# EAGLE design Modulo de expansao_01 (EAGLE 7.6.0)
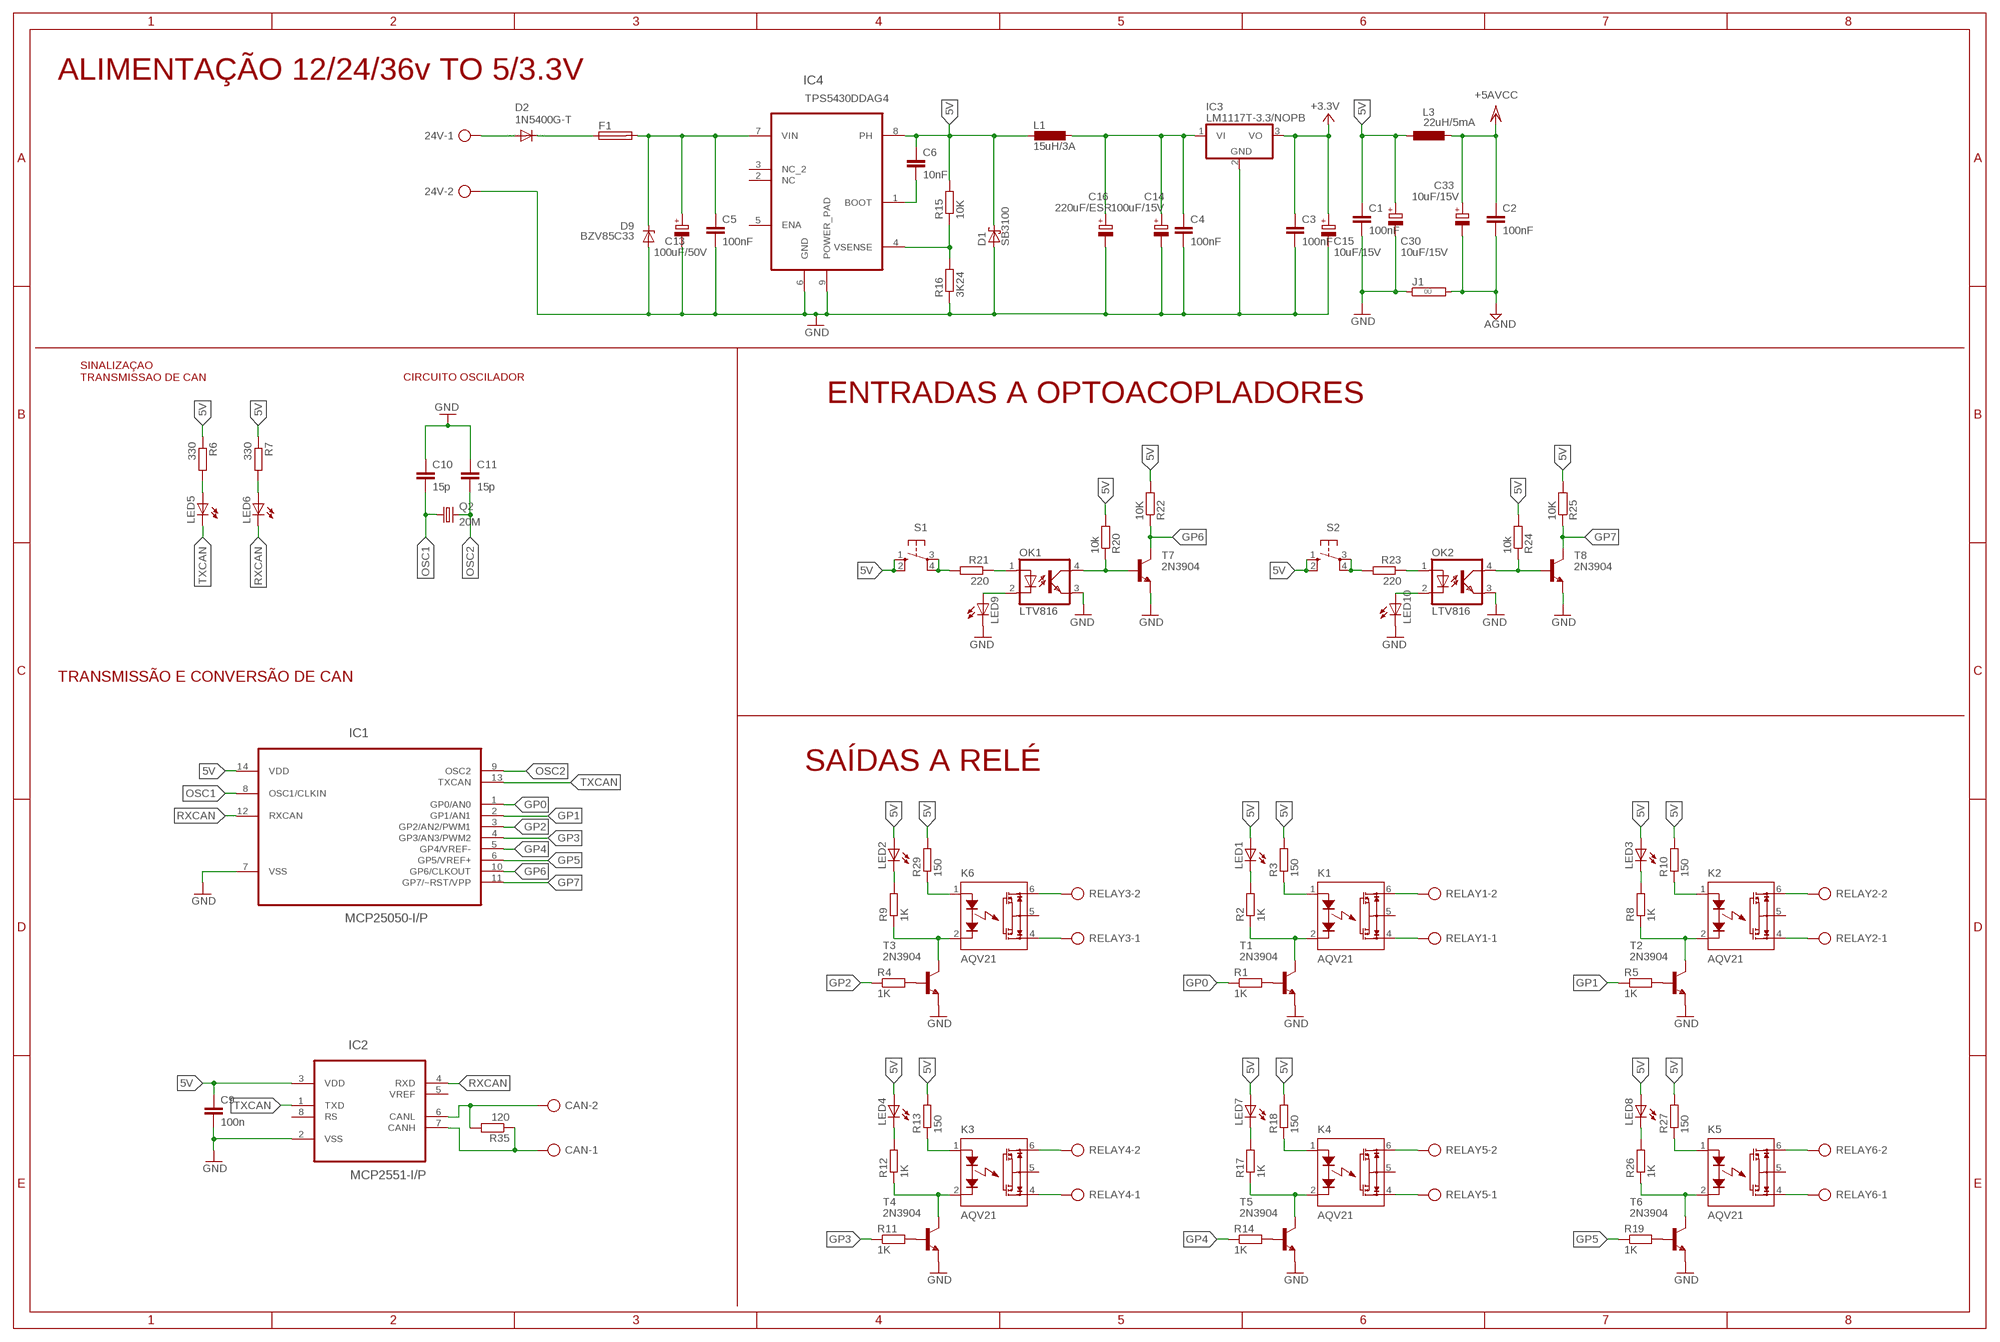
[diagram p0: schematic, sheet 1]

## Parts
24V  AK300/2  [AK300/2]
C1  100nF  C-EU050-024X044  [C050-024X044]
C2  100nF  C-EU050-024X044  [C050-024X044]
C3  100nF  C-EU050-024X044  [C050-024X044]
C4  100nF  C-EU050-024X044  [C050-024X044]
C5  100nF  C-EU050-024X044  [C050-024X044]
C6  10nF  C-EU025-025X050  [C025-025X050]
C9  100n  C-EU050-024X044  [C050-024X044]
C10  15p  C-EU025-024X044  [C025-024X044]
C11  15p  C-EU025-024X044  [C025-024X044]
C13  100uF/50V  CPOL-EUE3.5-10  [E3,5-10]
C14  100uF/15V  CPOL-EUE2-5  [E2-5]
C15  10uF/15V  CPOL-EUE2-5  [E2-5]
C16  220uF/ESR  CPOL-EUE2.5-7  [E2,5-7]
C30  10uF/15V  CPOL-EUE2.5-6  [E2,5-6]
C33  10uF/15V  CPOL-EUE2.5-6  [E2,5-6]
CAN  AK300/2  [AK300/2]
D1  SB3100  SCHOTTKY-DIODEDO201T15  [DO201T15]
D2  1N5400G-T  1N5624  [DO201-15]
D9  BZV85C33  BZV10  [DO34Z7]
F1  TR5  [TR5]
IC1  MCP25050-I/P  [DIP254P762X432-14]
IC2  MCP2551-I/P  [DIP254P762X432-8]
IC3  LM1117T-3.3/NOPB  LM340H-12  [TO220H]
IC4  TPS5430DDAG4  [SOIC127P600X170-9N]
J1  0R  [0R/10]
K1  AQV21  [DIL06]
K2  AQV21  [DIL06]
K3  AQV21  [DIL06]
K4  AQV21  [DIL06]
K5  AQV21  [DIL06]
K6  AQV21  [DIL06]
L1  15uH/3A  L-EU6000-XXX-RC  [6000-XXXX-RC]
L3  22uH/5mA  L-EU6000-XXX-RC  [6000-XXXX-RC]
LED1  LED3MM  [LED3MM]
LED2  LED3MM  [LED3MM]
LED3  LED3MM  [LED3MM]
LED4  LED3MM  [LED3MM]
LED5  LED3MM  [LED3MM]
LED6  LED3MM  [LED3MM]
LED7  LED3MM  [LED3MM]
LED8  LED3MM  [LED3MM]
LED9  LED3MM  [LED3MM]
LED10  LED3MM  [LED3MM]
OK1  LTV816  [DIL04]
OK2  LTV816  [DIL04]
Q2  20M  CRYSTALHC49S  [HC49/S]
R1  1K  R-EU_0207/10  [0207/10]
R2  1K  R-EU_0207/10  [0207/10]
R3  150  R-EU_0207/10  [0207/10]
R4  1K  R-EU_0207/10  [0207/10]
R5  1K  R-EU_0207/10  [0207/10]
R6  330  R-EU_0207/10  [0207/10]
R7  330  R-EU_0207/10  [0207/10]
R8  1K  R-EU_0207/10  [0207/10]
R9  1K  R-EU_0207/10  [0207/10]
R10  150  R-EU_0207/10  [0207/10]
R11  1K  R-EU_0207/10  [0207/10]
R12  1K  R-EU_0207/10  [0207/10]
R13  150  R-EU_0207/10  [0207/10]
R14  1K  R-EU_0207/10  [0207/10]
R15  10K  R-EU_0207/10  [0207/10]
R16  3K24  R-EU_0207/10  [0207/10]
R17  1K  R-EU_0207/10  [0207/10]
R18  150  R-EU_0207/10  [0207/10]
R19  1K  R-EU_0207/10  [0207/10]
R20  10k  R-EU_0207/10  [0207/10]
R21  220  R-EU_0207/10  [0207/10]
R22  10K  R-EU_0207/10  [0207/10]
R23  220  R-EU_0207/10  [0207/10]
R24  10k  R-EU_0207/10  [0207/10]
R25  10K  R-EU_0207/10  [0207/10]
R26  1K  R-EU_0207/10  [0207/10]
R27  150  R-EU_0207/10  [0207/10]
R29  150  R-EU_0207/10  [0207/10]
R35  120  R-EU_0207/10  [0207/10]
RELAY1  AK300/2  [AK300/2]
RELAY2  AK300/2  [AK300/2]
RELAY3  AK300/2  [AK300/2]
RELAY4  AK300/2  [AK300/2]
RELAY5  AK300/2  [AK300/2]
RELAY6  AK300/2  [AK300/2]
S1  10-XX  [B3F-10XX]
S2  10-XX  [B3F-10XX]
T1  2N3904  [TO92]
T2  2N3904  [TO92]
T3  2N3904  [TO92]
T4  2N3904  [TO92]
T5  2N3904  [TO92]
T6  2N3904  [TO92]
T7  2N3904  [TO92]
T8  2N3904  [TO92]

## Nets
5V: C1.1 C6.1 C9.1 C30.+ D1.C IC1.14(VDD) IC2.3(VDD) IC4.8(PH) L1.2 L3.1 LED1.A LED2.A LED3.A LED4.A LED7.A LED8.A R3.2 R6.1 R7.1 R10.2 R13.2 R15.2 R18.2 R20.2 R22.2 R24.2 R25.2 R27.2 R29.2 S1.1(S) S1.2(S1) S2.1(S) S2.2(S1)
24V: 24V.1 D2.A
+3.3V: C3.1 C15.+ IC3.3(VO)
AGND: C2.2 C33.- J1.2
GND: 24V.2 C1.2 C3.2 C4.2 C5.2 C9.2 C10.1 C11.1 C13.- C14.- C15.- C16.- C30.- D1.A D9.A IC1.7(VSS) IC2.2(VSS) IC3.2(GND) IC4.6(GND) IC4.9(POWER_PAD) J1.1 LED9.K(C) LED10.K(C) OK1.3(EMIT) OK2.3(EMIT) R16.1 T1.3(E) T2.3(E) T3.3(E) T4.3(E) T5.3(E) T6.3(E) T7.3(E) T8.3(E)
GP0: IC1.1(GP0/AN0) R1.1
GP1: IC1.2(GP1/AN1) R5.1
GP2: IC1.3(GP2/AN2/PWM1) R4.1
GP3: IC1.4(GP3/AN3/PWM2) R11.1
GP4: IC1.5(GP4/VREF-) R14.1
GP5: IC1.6(GP5/VREF+) R19.1
GP6: IC1.10(GP6/CLKOUT) R22.1 T7.1(C)
GP7: IC1.11(GP7/~RST/VPP) R25.1 T8.1(C)
N$1: LED1.K(C) R2.2
N$2: K1.2(K) R2.1 T1.1(C)
N$3: R1.2 T1.2(B)
N$4: K1.6(D1) RELAY1.2
N$5: K1.4(D2) RELAY1.1
N$6: LED3.K(C) R8.2
N$7: K2.2(K) R8.1 T2.1(C)
N$8: R5.2 T2.2(B)
N$9: K2.6(D1) RELAY2.2
N$10: R4.2 T3.2(B)
N$11: LED2.K(C) R9.2
N$12: K6.2(K) R9.1 T3.1(C)
N$13: K6.6(D1) RELAY3.2
N$14: K6.4(D2) RELAY3.1
N$15: K2.4(D2) RELAY2.1
N$16: LED4.K(C) R12.2
N$17: K3.2(K) R12.1 T4.1(C)
N$18: R11.2 T4.2(B)
N$19: K3.6(D1) RELAY4.2
N$20: K3.4(D2) RELAY4.1
N$21: C5.1 C13.+ D9.C F1.2 IC4.7(VIN)
N$22: LED7.K(C) R17.2
N$23: D2.C F1.1
N$24: LED5.A R6.2
N$25: LED6.A R7.2
N$26: K4.2(K) R17.1 T5.1(C)
N$27: R14.2 T5.2(B)
N$28: K4.6(D1) RELAY5.2
N$29: K4.4(D2) RELAY5.1
N$30: LED8.K(C) R26.2
N$31: CAN.2 IC2.6(CANL) R35.2
N$32: CAN.1 IC2.7(CANH) R35.1
N$33: K5.2(K) R26.1 T6.1(C)
N$34: R19.2 T6.2(B)
N$35: K5.6(D1) RELAY6.2
N$36: K5.4(D2) RELAY6.1
N$37: OK1.4(COL) R20.1 T7.2(B)
N$38: R23.2 S2.3(P) S2.4(P1)
N$39: OK2.1(A) R23.1
N$40: OK2.4(COL) R24.1 T8.2(B)
N$41: LED9.A OK1.2(C)
N$42: LED10.A OK2.2(C)
N$43: K2.1(A) R10.1
N$44: K4.1(A) R18.1
N$45: K1.1(A) R3.1
N$46: K3.1(A) R13.1
N$47: K5.1(A) R27.1
N$48: K6.1(A) R29.1
N$57: R21.2 S1.3(P) S1.4(P1)
N$59: OK1.1(A) R21.1
N$65: C4.1 C14.+ C16.+ IC3.1(VI) L1.1
N$66: C6.2 IC4.1(BOOT)
N$67: IC4.4(VSENSE) R15.1 R16.2
OSC1: C10.2 IC1.8(OSC1/CLKIN) Q2.1
OSC2: C11.2 IC1.9(OSC2) Q2.2
RXCAN: IC1.12(RXCAN) IC2.4(RXD) LED6.K(C)
TXCAN: IC1.13(TXCAN) IC2.1(TXD) LED5.K(C)
VCC/2: C2.1 C33.+ L3.2 ; supply symbol labelled +5AVCC
Unconnected: IC2.5(VREF) IC2.8(RS) IC4.2(NC) IC4.3(NC_2) IC4.5(ENA) K1.5(S) K2.5(S) K3.5(S) K4.5(S) K5.5(S) K6.5(S)

## Notes on the sheet
- ALIMENTAÇÃO 12/24/36v TO 5/3.3V
- SINALIZAÇAO
  TRANSMISSAO DE CAN
- CIRCUITO OSCILADOR
- ENTRADAS A OPTOACOPLADORES
- TRANSMISSÃO E CONVERSÃO DE CAN
- SAÍDAS A RELÉ

## Library data of the parts
24V CAN RELAY1-RELAY6 = con-ptr500:AK300/2: CONNECTOR; OC_FARNELL: unknown; OC_NEWARK: unknown
C1-C6 C9-C11 = rcl:C-EU: CAPACITOR, European symbol
C13-C16 C30 C33 = rcl:CPOL-EU: POLARIZED CAPACITOR, European symbol
D1 = diode:SCHOTTKY-DIODE: Schottky Diode
D2 = diode:1N5624: DIODE controlled avalanche rectifier
D9 = diode:BZV10: Z DIODE
F1 = fuse:TR5: FUSE Wickmann; OC_FARNELL: unknown; OC_NEWARK: unknown
IC1 = MCP25050-IP:MCP25050-I/P: CAN I/O Expander Family; MPN: MCP25050-I/P; OC_FARNELL: 1439736; OC_NEWARK: 59K0224; PACKAGE: DIP-14; SUPPLIER: Microchip
IC2 = MCP2551-IP:MCP2551-I/P: High-Speed CAN Transceiver; DESCRIPTION: CAN CTRL; MPN: MCP2551-I/P; OC_FARNELL: 1292240; OC_NEWARK: 61K2947; PACKAGE: PDIP-8; SUPPLIER: Microchip
IC3 = linear:LM340?-*: Positive VOLTAGE REGULATOR Source: http://cache.national.com/ds/LM/LM340.pdf
IC4 = texas_tps5430:TPS5430DDAG4: 3-A, WIDE INPUT RANGE, STEP-DOWN SWIFT CONVERTER; MPN: TPS5430DDAG4; OC_FARNELL: 1220987; OC_NEWARK: 05M1620; PACKAGE: SOIC-8; SUPPLIER: TEXAS INSTRUMENTS
J1 = jumper:0R: Bridge 0R 10mm
K1-K6 = relay:AQV*: PhotoMOS Relay NAiS Source: Data sheet <http://www.panasonic-electric-works.com/catalogues/downloads/photomos/ds_x615_en_aqv10_20.pdf>; MPN: AQV210; OC_FARNELL: 1704179; OC_NEWARK: 13P0968
L1 L3 = rcl:L-EU: INDUCTOR, European symbol
LED1-LED10 = led:LED: LED OSRAM: - CHIPLED LG R971, LG N971, LY N971, LG Q971, LY Q971, LO R971, LY R971 LH N974, LH R974 LS Q976, LO Q976, LY Q976 LO Q996 - Hyper CHIPLED LW Q18S LB Q993, LB Q99A, LB R99A - SideLED LS A670, LO A670, LY A670, LG A670, LP A670 LB A673, LV A673, LT A673, LW A673 LH A674 LY A675 LS A676, LA A676, LO A676, LY A676, LW A676 LS A679, LY A679, LG A679 - Hyper Micro SIDELED® LS Y876, LA Y876, LO Y876, LY Y876 LT Y87S - SmartLED LW L88C, LW L88S LB L89C, LB L89S, LG L890 LS L89K, LO L89K, LY L89K LS L896, LA L896, LO L896, LY L896 - TOPLED LS T670, LO T670, LY T670, LG T670, LP T670 LSG T670, LSP T670, LSY T670, LOP T670, LYG T670 LG T671, LOG T671, LSG T671 LB T673, LV T673, LT T673, LW T673 LH T674 LS T676, LA T676, LO T676, LY T676, LB T676, LH T676, LSB T676, LW T676 LB T67C, LV T67C, LT T67C, LS T67K, LO T67K, LY T67K, LW E67C LS E67B, LA E67B, LO E67B, LY E67B, LB E67C, LV E67C, LT E67C LW T67C LS T679, LY T679, LG T679 LS T770, LO T770, LY T770, LG T770, LP T770 LB T773, LV T773, LT T773, LW T773 LH T774 LS E675, LA E675, LY E675, LS T675 LS T776, LA T776, LO T776, LY T776, LB T776 LHGB T686 LT T68C, LB T68C - Hyper Mini TOPLED® LB M676 - Mini TOPLED Santana® LG M470 LS M47K, LO M47K, LY M47K Source: http://www.osram.convergy.de LUXEON: - LUMILED® LXK2-PW12-R00, LXK2-PW12-S00, LXK2-PW14-U00, LXK2-PW14-V00 LXK2-PM12-R00, LXK2-PM12-S00, LXK2-PM14-U00 LXK2-PE12-Q00, LXK2-PE12-R00, LXK2-PE12-S00, LXK2-PE14-T00, LXK2-PE14-U00 LXK2-PB12-K00, LXK2-PB12-L00, LXK2-PB12-M00, LXK2-PB14-N00, LXK2-PB14-P00, LXK2-PB14-Q00 LXK2-PR12-L00, LXK2-PR12-M00, LXK2-PR14-Q00, LXK2-PR14-R00 LXK2-PD12-Q00, LXK2-PD12-R00, LXK2-PD12-S00 LXK2-PH12-R00, LXK2-PH12-S00 LXK2-PL12-P00, LXK2-PL12-Q00, LXK2-PL12-R00 Source: www.luxeon.com KINGBRIGHT: KA-3528ASYC Source: www.kingbright.com
OK1 OK2 = optocoupler:LTV816: OPTO COUPLER Source: LITEON, LTV816.pdf; OC_FARNELL: unknown; OC_NEWARK: unknown
Q2 = crystal:CRYSTAL: CRYSTAL; OC_FARNELL: 1667008; OC_NEWARK: unknown
R1-R27 R29 R35 = rcl:R-EU_: RESISTOR, European symbol
S1 S2 = switch-omron:10-XX: OMRON SWITCH; MPN: B3F-1000; OC_FARNELL: 176432; OC_NEWARK: 36M3542
T1-T8 = transistor:2N3904: NPN TRANSISTOR

## Net classes
0 default: width 0.406 mm, drill 0.6 mm

## Board
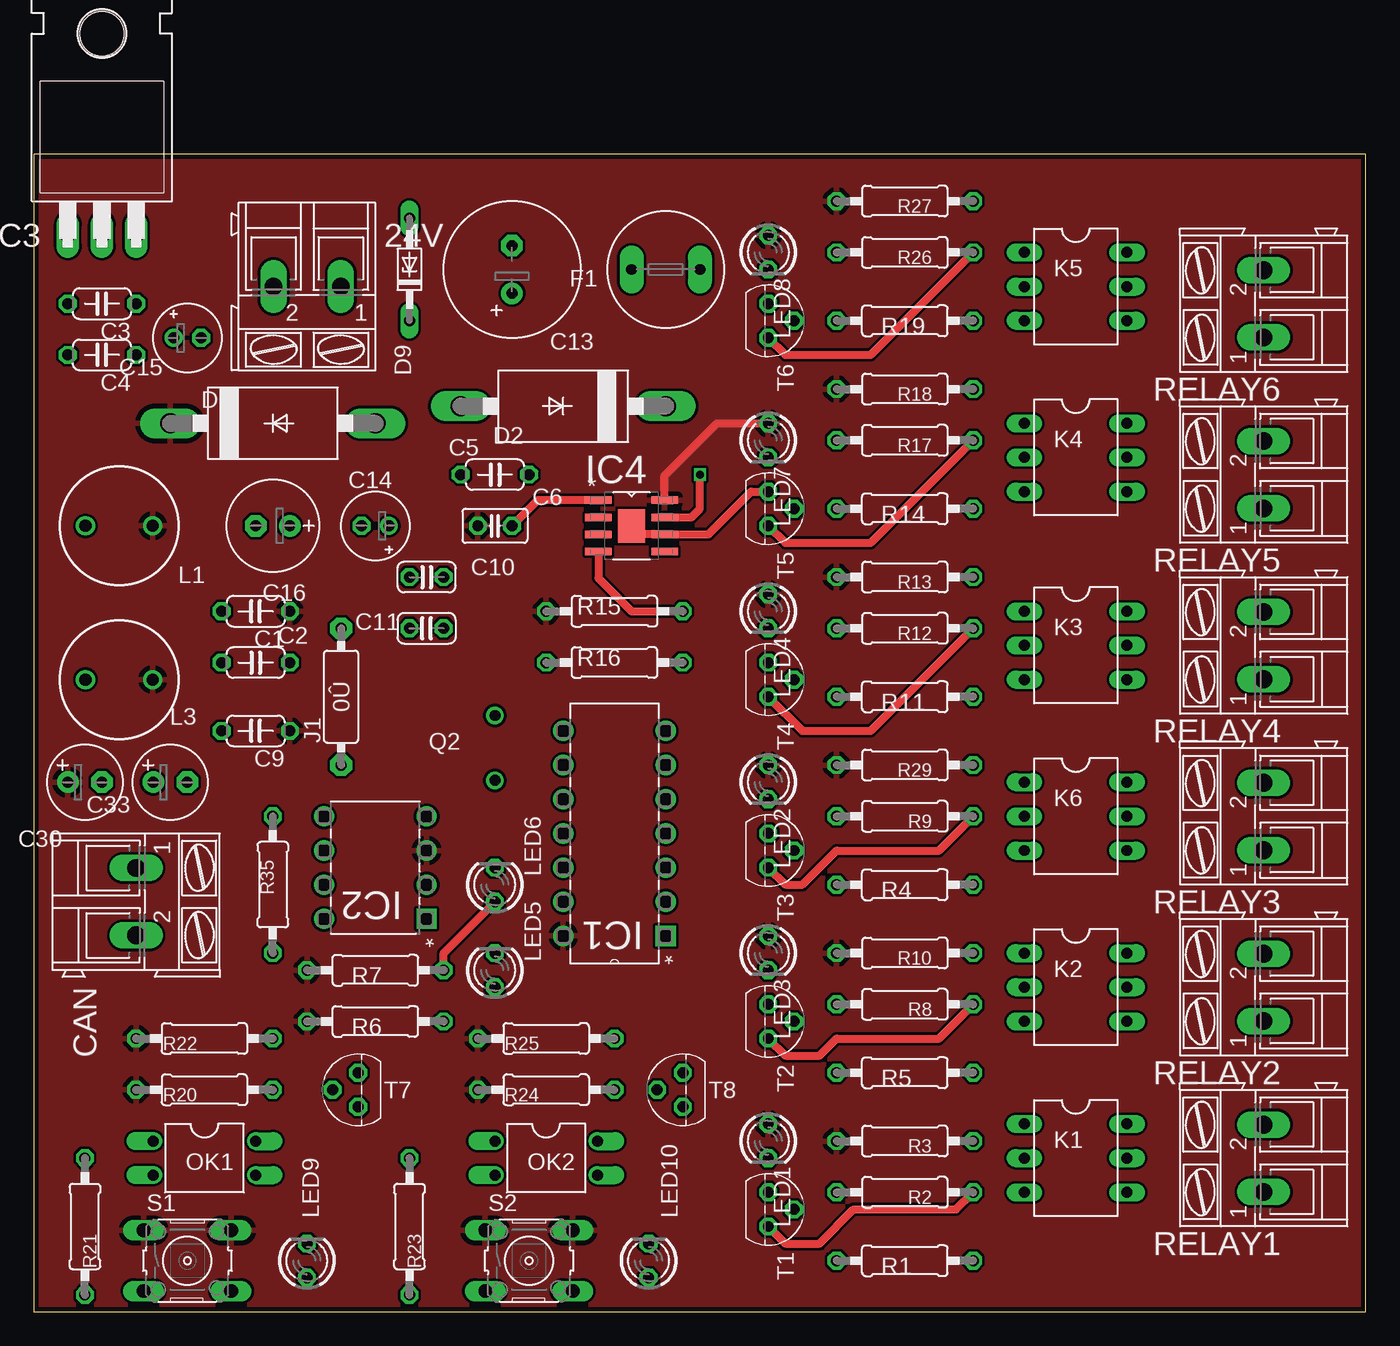
[diagram p1: board, top side]
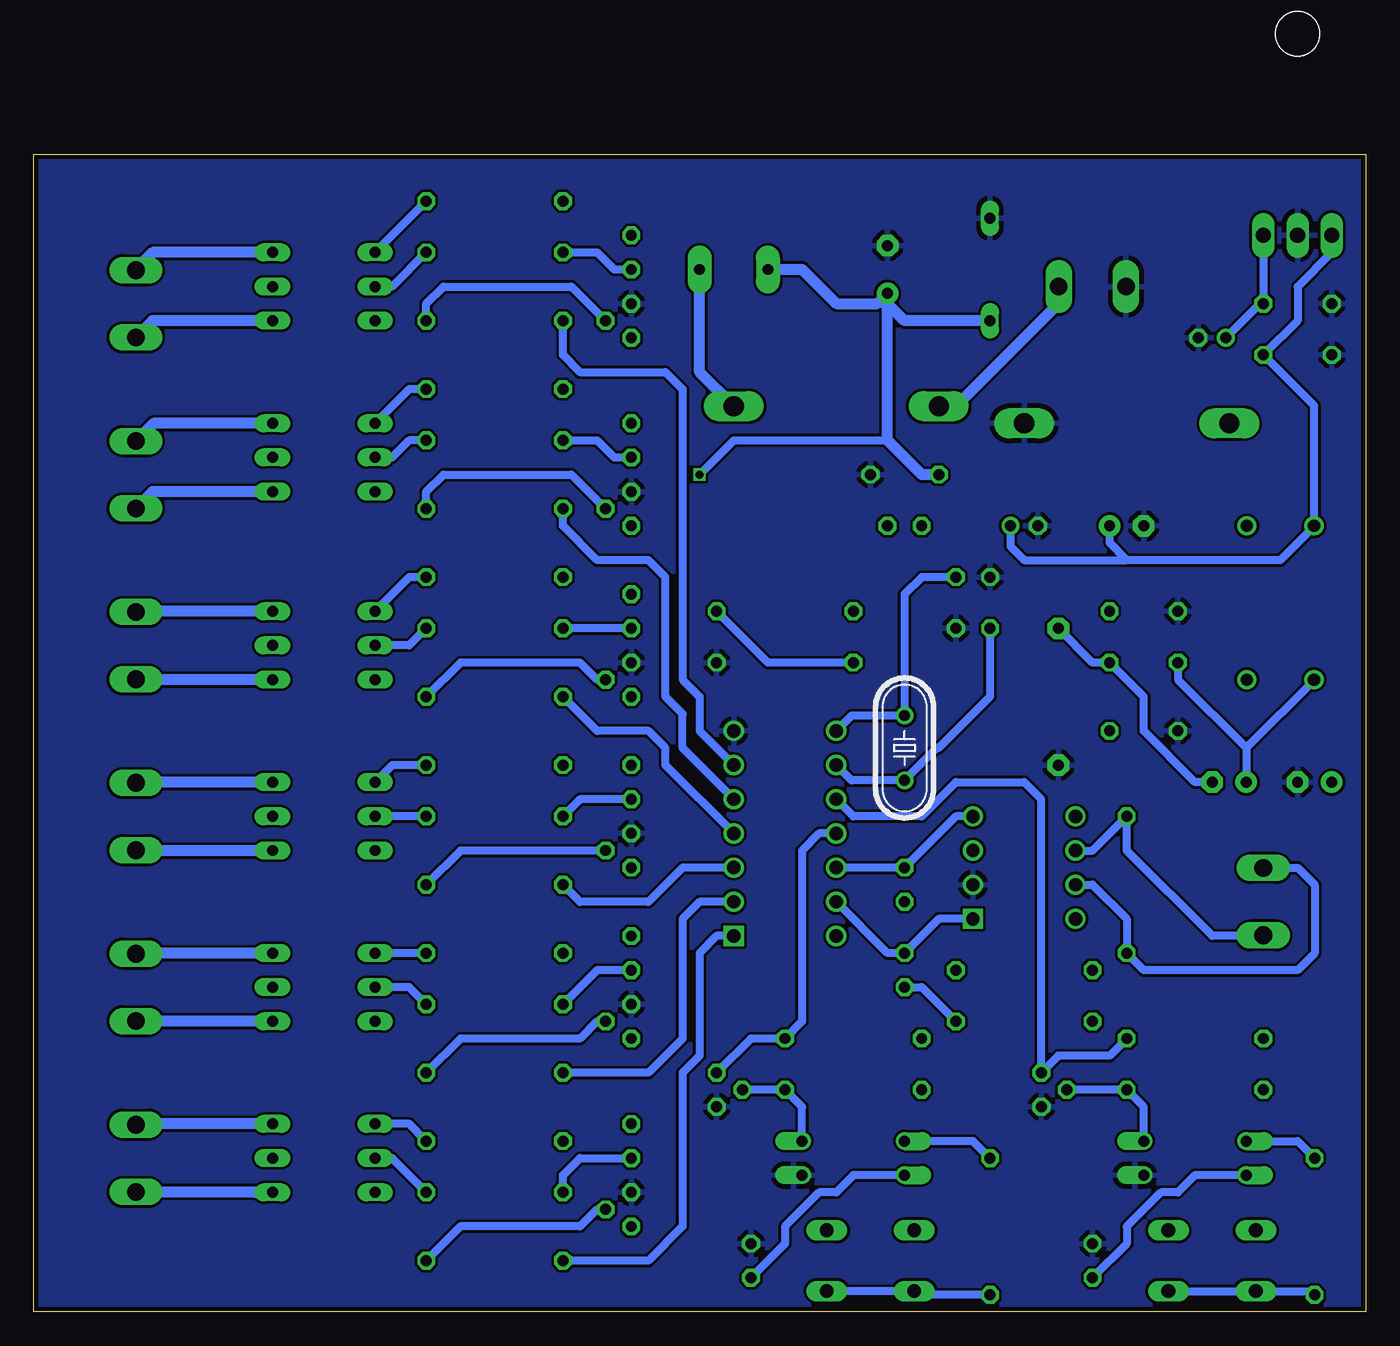
[diagram p2: board, bottom side, seen from below]

Size 99.04 x 86.03 mm. Coordinates in mm from the lower left corner, seen from the top.
Outline: 0,0 99.04,0 99.04,86.03 0,86.03 0,0
Copper layers (1*16): Top 0.035mm / dielectric 1.5mm / Bottom 0.035mm
Design rules "rules_IPCA_EEC_v2017": minimum track width 6mil, minimum drill 0.6mm, track to track 8mil, track to pad 14mil, pad to pad 14mil, via to via 8mil, smd to smd 8mil, copper to edge 14mil, drill to drill 14mil, minimum pad ring 10mil, minimum via ring 6mil, stop-mask expansion 2mil, vias tented up to drill 100mil, thermal gap 14mil

### Footprints (pad centres in the part's own frame; a part is rotated, then mirrored left to right if it is on the bottom)
AK300/2 = drill 1.321 long: 1 -2.515,0; 2 2.489,0
C050-024X044 = drill 0.813 octagon: 1 -2.54,0; 2 2.54,0
C025-025X050 = drill 0.813 octagon: 1 -1.27,0; 2 1.27,0
C025-024X044 = drill 0.813 octagon: 1 -1.27,0; 2 1.27,0
E3,5-10 = drill 0.813 pad 1.6: + -1.778,0 | drill 0.813 pad 1.6 octagon: - 1.778,0
E2-5 = drill 0.813 pad 1.27: + -1.016,0 | drill 0.813 pad 1.27 octagon: - 1.016,0
E2,5-7 = drill 0.813 pad 1.6: + -1.27,0 | drill 0.813 pad 1.6 octagon: - 1.27,0
E2,5-6 = drill 0.813 pad 1.6: + -1.27,0 | drill 0.813 pad 1.6 octagon: - 1.27,0
C2673 = drill 1.499 long: A 7.62,0; C -7.62,0
DO34Z7 = drill 0.813 long: A 3.81,0; C -3.81,0
TR5 = drill 0.813 pad 1.778 long: 1 -2.54,0; 2 2.54,0
DIP254P762X432-14 = drill 0.991 square: 1 -7.62,15.24 | drill 0.991: 2 -7.62,12.7; 3 -7.62,10.16; 4 -7.62,7.62; 5 -7.62,5.08; 6 -7.62,2.54; 7 -7.62,0; 8 0,0; 9 0,2.54; 10 0,5.08; 11 0,7.62; 12 0,10.16; 13 0,12.7; 14 0,15.24
DIP254P762X432-8 = drill 0.991 square: 1 -7.62,7.62 | drill 0.991: 2 -7.62,5.08; 3 -7.62,2.54; 4 -7.62,0; 5 0,0; 6 0,2.54; 7 0,5.08; 8 0,7.62
TO220H = drill 1.118 long: 1 -2.54,-10.16; 2 0,-10.16; 3 2.54,-10.16 | hole 3.302: 0,4.826
SOIC127P600X170-9N = smd 1.981 x 0.559: 1 -2.464,1.905; 2 -2.464,0.635; 3 -2.464,-0.635; 4 -2.464,-1.905; 5 2.464,-1.905; 6 2.464,-0.635; 7 2.464,0.635; 8 2.464,1.905 | smd 2.007 x 2.489: 9 0,0
0R/10 = drill 0.813 pad 1.6 octagon: 1 -5.08,0; 2 5.08,0
DIL06 = drill 0.813 long: 1 -2.54,-3.81; 2 0,-3.81; 3 2.54,-3.81; 4 2.54,3.81; 5 0,3.81; 6 -2.54,3.81
6000-XXXX-RC = drill 0.9 pad 1.422: 1 -2.5,0; 2 2.5,0
LED3MM = drill 0.813 octagon: A -1.27,0; K 1.27,0
DIL04 = drill 0.813 offset: 1 -1.27,-3.81; 2 1.27,-3.81; 3 1.27,3.81; 4 -1.27,3.81
HC49/S = drill 0.813: 1 -2.413,0; 2 2.413,0
0207/10 = drill 0.813 octagon: 1 -5.08,0; 2 5.08,0
B3F-10XX = drill 1.016 long: 1 -3.251,2.261; 2 3.251,2.261; 3 -3.251,-2.261; 4 3.251,-2.261
TO92 = drill 0.813 octagon: 1 1.27,0; 2 0,1.905; 3 -1.27,0

### Placement (x,y rotation side)
24V  20.32,76.2 180 top
C1  16.51,52.07 180 top
C2  16.51,48.26 0 top
C3  5.08,74.93 180 top
C4  5.08,71.12 180 top
C5  34.29,62.23 0 top
C6  34.29,58.42 0 top
C9  16.51,43.18 180 top
C10  29.21,54.61 0 top
C11  29.21,50.8 180 top
C13  35.56,77.47 90 top
C14  25.4,58.42 180 top
C15  11.43,72.39 0 top
C16  17.78,58.42 180 top
C30  3.81,39.37 0 top
C33  10.16,39.37 0 top
CAN  7.62,30.48 270 top
D1  SB3100  [C2673]  17.78,66.04 0 top
D2  1N5400G-T  [C2673]  39.37,67.31 180 top
D9  27.94,77.47 90 top
F1  46.99,77.47 180 top
IC1  39.37,43.18 180 top
IC2  21.59,36.83 180 top
IC3  5.08,90.17 0 top
IC4  44.45,58.42 0 top
J1  22.86,45.72 90 top
K1  77.47,11.43 270 top
K2  77.47,24.13 270 top
K3  77.47,49.53 270 top
K4  77.47,63.5 270 top
K5  77.47,76.2 270 top
K6  77.47,36.83 270 top
L1  6.35,58.42 0 top
L3  6.35,46.99 180 top
LED1  54.61,12.7 270 top
LED2  54.61,39.37 270 top
LED3  54.61,26.67 270 top
LED4  54.61,52.07 270 top
LED5  34.29,25.4 90 top
LED6  34.29,31.75 90 top
LED7  54.61,64.77 270 top
LED8  54.61,78.74 270 top
LED9  20.32,3.81 90 top
LED10  45.72,3.81 90 top
OK1  12.7,11.43 270 top
OK2  38.1,11.43 270 top
Q2  34.29,41.91 270 bottom
R1  64.77,3.81 0 top
R2  64.77,8.89 180 top
R3  64.77,12.7 180 top
R4  64.77,31.75 0 top
R5  64.77,17.78 0 top
R6  25.4,21.59 0 top
R7  25.4,25.4 0 top
R8  64.77,22.86 180 top
R9  64.77,36.83 180 top
R10  64.77,26.67 180 top
R11  64.77,45.72 0 top
R12  64.77,50.8 180 top
R13  64.77,54.61 180 top
R14  64.77,59.69 0 top
R15  43.18,52.07 180 top
R16  43.18,48.26 180 top
R17  64.77,64.77 180 top
R18  64.77,68.58 180 top
R19  64.77,73.66 0 top
R20  12.7,16.51 180 top
R21  3.81,6.35 270 top
R22  12.7,20.32 180 top
R23  27.94,6.35 270 top
R24  38.1,16.51 180 top
R25  38.1,20.32 180 top
R26  64.77,78.74 180 top
R27  64.77,82.55 180 top
R29  64.77,40.64 180 top
R35  17.78,31.75 90 top
RELAY1  91.44,11.43 90 top
RELAY2  91.44,24.13 90 top
RELAY3  91.44,36.83 90 top
RELAY4  91.44,49.53 90 top
RELAY5  91.44,62.23 90 top
RELAY6  91.44,74.93 90 top
S1  11.43,3.81 0 top
S2  36.83,3.81 0 top
T1  54.61,7.62 270 top
T2  54.61,21.59 270 top
T3  54.61,34.29 270 top
T4  54.61,46.99 270 top
T5  54.61,59.69 270 top
T6  54.61,73.66 270 top
T7  24.13,16.51 90 top
T8  48.26,16.51 90 top

### Tracks (layer width: path | path; a pad name or v marks a point on that pad's centre or on a via)
5V
  Top 0.61: IC4.8 46.91,62.15 50.8,66.04 LED7.A
  pour Top: -5.08,91.44 104.14,91.44 104.14,-3.81 -5.08,-3.81
24V
  Bottom 0.813: 24V.1 22.84,74.95 30.48,67.31 D2.A
+3.3V
  Bottom 0.61: IC3.3 C3.1 7.87,74.93 C15.+
AGND
  Bottom 0.61: C33.- 12.7,39.37 16.51,43.18 16.51,45.72 C2.2 20.32,48.26 J1.2
GND
  Top 0.61: IC4.9 45.09,57.78 IC4.6 50.16,57.78 53.34,60.96 T5.3
  pour Bottom: -3.81,87.63 102.87,87.63 102.87,-2.54 -3.81,-2.54
GP0
  Bottom 0.61: IC1.1 48.26,27.94 49.53,26.67 49.53,19.05 50.8,17.78 50.8,6.35 53.34,3.81 R1.1
GP1
  Bottom 0.61: IC1.2 49.53,30.48 50.8,29.21 50.8,20.32 53.34,17.78 R5.1
GP2
  Bottom 0.61: IC1.3 50.8,33.02 53.34,30.48 58.42,30.48 R4.1
GP3
  Bottom 0.61: IC1.4 52.07,40.64 52.07,41.91 53.34,43.18 57.15,43.18 R11.1
GP4
  Bottom 0.61: IC1.5 50.8,41.91 50.8,44.45 52.07,45.72 52.07,54.61 53.34,55.88 57.15,55.88 59.69,58.42 R14.1
GP5
  Bottom 0.61: IC1.6 49.53,43.18 49.53,45.72 50.8,46.99 50.8,68.58 52.07,69.85 58.42,69.85 59.69,71.12 R19.1
GP6
  Bottom 0.61: R22.1 19.05,19.05 22.86,19.05 T7.1 24.13,38.1 25.4,39.37 30.48,39.37 33.02,36.83 38.1,36.83 IC1.10
GP7
  Bottom 0.61: IC1.11 40.64,35.56 41.91,34.29 41.91,21.59 R25.1 45.72,20.32 T8.1
N$1
  Bottom 0.61: R2.2 59.69,10.16 58.42,11.43 LED1.K
N$2
  Top 0.61: T1.1 55.88,5.08 58.42,5.08 60.96,7.62 68.58,7.62 R2.1
  Bottom 0.61: R2.1 72.39,11.43 K1.2
N$3
  Bottom 0.61: T1.2 57.15,7.62 58.42,6.35 67.31,6.35 R1.2
N$4
  Bottom 0.813: K1.6 91.39,13.97 RELAY1.2
N$5
  Bottom 0.813: RELAY1.1 82.57,8.91 82.55,8.89 K1.4
N$6
  Bottom 0.61: LED3.K 57.15,25.4 R8.2
N$7
  Top 0.61: T2.1 55.88,19.05 58.42,19.05 59.69,20.32 67.31,20.32 R8.1
  Bottom 0.61: R8.1 71.12,24.13 K2.2
N$8
  Bottom 0.61: T2.2 57.15,21.59 58.42,20.32 67.31,20.32 R5.2
N$9
  Bottom 0.813: K2.6 91.39,26.67 RELAY2.2
N$10
  Bottom 0.61: T3.2 67.31,34.29 R4.2
N$11
  Bottom 0.61: LED2.K 58.42,38.1 R9.2
N$12
  Top 0.61: T3.1 55.88,31.75 57.15,31.75 59.69,34.29 67.31,34.29 R9.1
  Bottom 0.61: R9.1 K6.2
N$13
  Bottom 0.813: K6.6 91.39,39.37 RELAY3.2
N$14
  Bottom 0.813: K6.4 91.41,34.29 RELAY3.1
N$15
  Bottom 0.813: K2.4 91.41,21.59 RELAY2.1
N$16
  Bottom 0.61: LED4.K R12.2
N$17
  Top 0.61: T4.1 57.15,43.18 62.23,43.18 R12.1
  Bottom 0.61: R12.1 71.12,49.53 K3.2
N$18
  Bottom 0.61: T4.2 57.15,46.99 58.42,48.26 67.31,48.26 R11.2
N$19
  Bottom 0.813: K3.6 91.39,52.07 RELAY4.2
N$20
  Bottom 0.813: K3.4 91.41,46.99 RELAY4.1
N$21  (via drill 0.6)
  Top 0.61: IC4.7 48.9,59.05 49.53,59.69 v49.53,62.23
  Bottom 0.61: 34.29,63.5 33.02,62.23 | v49.53,62.23 46.99,64.77 35.56,64.77
  Bottom 0.813: F1.2 41.91,77.47 39.37,74.93 36.32,74.93 35.94,75.31 | 35.94,75.31 C13.+ | D9.C 34.29,73.66 35.56,74.93 | 35.56,74.93 35.94,75.31 | C5.1 33.02,62.23 35.56,64.77 35.56,74.93
N$22
  Bottom 0.61: R17.2 57.15,64.77 55.88,63.5 LED7.K
N$23
  Bottom 0.813: D2.C 49.53,69.85 F1.1
N$24
  Bottom 0.61: LED5.A 33.02,24.13 R6.2
N$25
  Top 0.61: R7.2 30.48,26.67 LED6.A
N$26
  Top 0.61: T5.1 55.88,57.15 62.23,57.15 R17.1
  Bottom 0.61: R17.1 71.12,64.77 72.39,63.5 K4.2
N$27
  Bottom 0.61: R14.2 69.85,60.96 68.58,62.23 59.05,62.23 T5.2
N$28
  Bottom 0.813: K4.6 90.12,66.04 RELAY5.2
N$29
  Bottom 0.813: K4.4 90.19,60.96 RELAY5.1
N$30
  Bottom 0.61: R26.2 57.15,78.74 55.88,77.47 LED8.K
N$31
  Bottom 0.61: IC2.6 20.32,34.29 R35.2 17.78,34.29 11.43,27.94 7.67,27.94 CAN.2
N$32
  Bottom 0.61: IC2.7 20.32,31.75 17.78,29.21 R35.1 16.51,25.4 5.08,25.4 3.81,26.67 3.81,31.75 5.05,32.99 CAN.1
N$33
  Top 0.61: T6.1 55.88,71.12 62.23,71.12 R26.1
  Bottom 0.61: R26.1 72.39,76.2 K5.2
N$34
  Bottom 0.61: R19.2 69.85,74.93 68.58,76.2 59.05,76.2 T6.2
N$35
  Bottom 0.813: K5.6 90.17,78.74 91.44,77.47 RELAY6.2
N$36
  Bottom 0.813: K5.4 90.19,73.66 RELAY6.1
N$37
  Bottom 0.61: OK1.4 16.51,15.24 R20.1 T7.2
N$38
  Bottom 0.61: R23.2 33.3,1.27 S2.3 S2.4
N$39
  Bottom 0.61: R23.1 29.21,12.7 OK2.1
N$40
  Bottom 0.61: OK2.4 41.91,15.24 R24.1 T8.2
N$41
  Bottom 0.61: OK1.2 12.7,10.16 13.97,8.89 15.24,8.89 17.78,6.35 17.78,5.08 LED9.A
N$42
  Bottom 0.61: OK2.2 38.1,10.16 39.37,8.89 40.64,8.89 43.18,6.35 43.18,5.08 LED10.A
N$43
  Bottom 0.61: R10.1 K2.1
N$44
  Bottom 0.61: R18.1 71.12,68.58 K4.1
N$45
  Bottom 0.61: R3.1 71.12,13.97 K1.1
N$46
  Bottom 0.61: R13.1 71.12,54.61 K3.1
N$47
  Bottom 0.61: R27.1 K5.1
N$48
  Bottom 0.61: R29.1 72.39,40.64 K6.1
N$57
  Bottom 0.61: R21.2 4.09,1.55 S1.3 S1.4
N$59
  Bottom 0.61: OK1.1 5.08,12.7 R21.1
N$65
  Bottom 0.61: IC3.1 2.54,78.74 5.08,76.2 5.08,73.66 C4.1 3.85,67.35 L1.1 3.85,58.38 6.35,55.88 17.78,55.88 | 17.78,55.88 19.05,57.15 C16.+ | C14.+ 26.42,56.9 25.4,55.88 17.78,55.88
N$66
  Top 0.61: IC4.1 37.47,60.33 C6.2
N$67
  Top 0.61: IC4.4 41.99,54.53 44.45,52.07 R15.1
  Bottom 0.61: R16.2 44.45,48.26 R15.1
OSC1
  Bottom 0.61: C10.2 33.02,54.61 34.29,53.34 Q2.1 38.23,44.32 IC1.8
OSC2
  Bottom 0.61: C11.2 27.94,45.72 31.75,41.91 31.88,41.91 Q2.2 38.23,39.5 IC1.9
RXCAN
  Bottom 0.61: IC2.4 30.48,36.83 LED6.K IC1.12
TXCAN
  Bottom 0.61: IC2.1 31.75,29.21 LED5.K 35.56,26.67 IC1.13
VCC/2
  Bottom 0.61: L3.2 3.85,46.95 8.89,41.91 | 8.89,41.91 C33.+ | C2.1 13.97,46.99 8.89,41.91